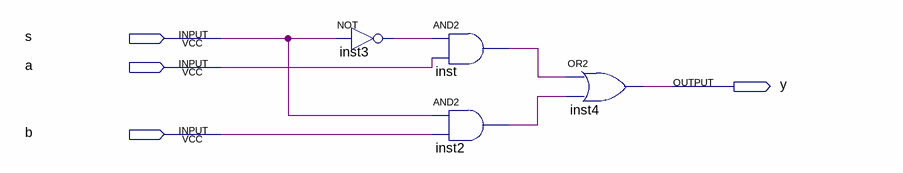
[diagram p0: schematic sheet]
// Quartus schematic simple_muxer.bdf as structural Verilog: 4 symbols, 4 pins
module simple_muxer (
  input  s,
  input  a,
  input  b,
  output y
);

  wire inst2_out, inst3_out, inst_out;

  not inst3 (inst3_out, s);
  and inst (inst_out, inst3_out, a);
  and inst2 (inst2_out, s, b);
  or inst4 (y, inst_out, inst2_out);
endmodule
